# EAGLE design HackRPI-Badge (EAGLE 7.6.0)
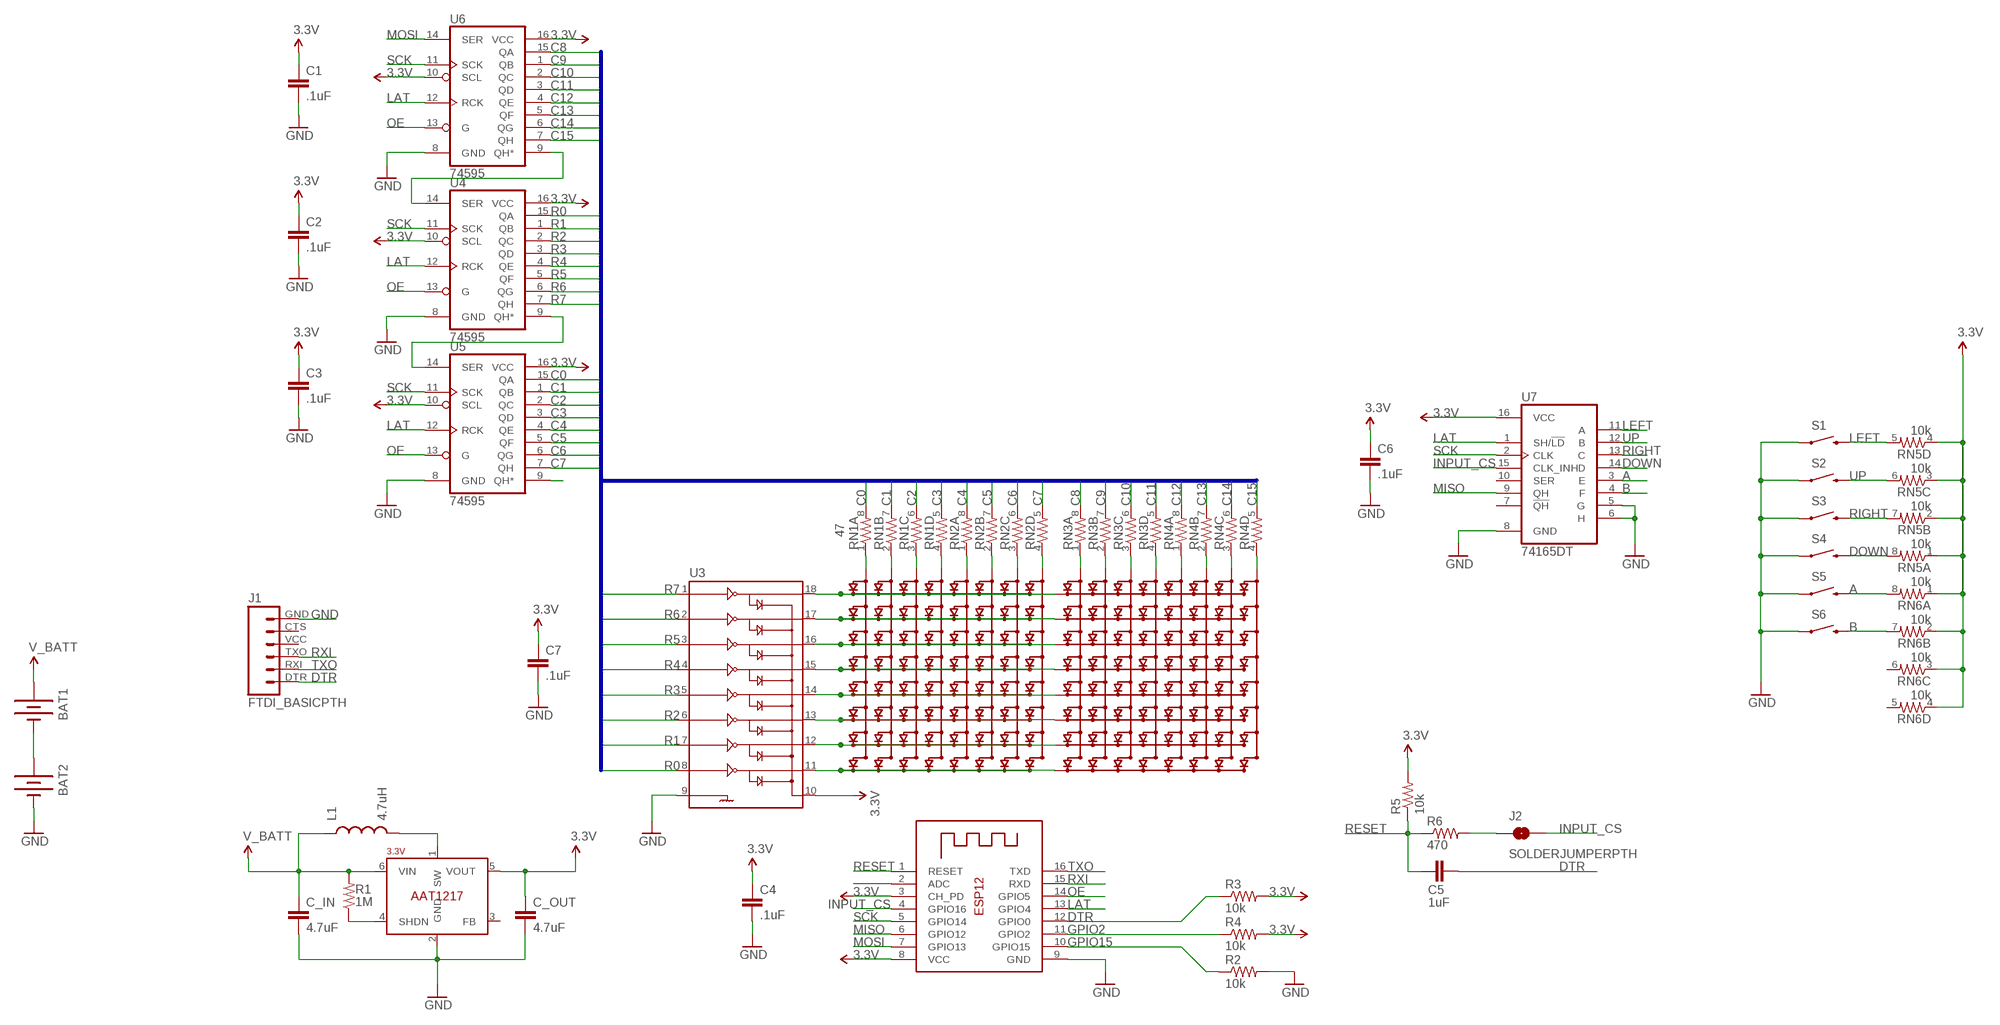
[diagram p0: schematic, sheet 1]

## Parts
BAT1  BATTERYAAA  [BATTERY-AAA]
BAT2  BATTERYAAA  [BATTERY-AAA]
C1  .1uF  CAP0603-CAP  [0603-CAP]
C2  .1uF  CAP0603-CAP  [0603-CAP]
C3  .1uF  CAP0603-CAP  [0603-CAP]
C4  .1uF  CAP0603-CAP  [0603-CAP]
C5  1uF  CAP0603-CAP  [0603-CAP]
C6  .1uF  CAP0603-CAP  [0603-CAP]
C7  .1uF  CAP0603-CAP  [0603-CAP]
C_IN  4.7uF  CAP0805  [0805]
C_OUT  4.7uF  CAP0805  [0805]
J1  FTDI_BASICPTH  [FTDI_BASIC]
J2  SOLDERJUMPERPTH  [SJ_2S-PTH]
L1  4.7uH  INDUCTOR1007  [1007]
LED_LEFT  8X8LEDMATRIX_COLUMN_CATHODELDM-13488MI  [32MM_LEDMATRIX]
LED_RIGHT  8X8LEDMATRIX_COLUMN_CATHODELDM-13488MI  [32MM_LEDMATRIX]
R1  1M  RESISTOR0603  [0603-RES]
R2  10k  RESISTOR0603  [0603-RES]
R3  10k  RESISTOR0603  [0603-RES]
R4  10k  RESISTOR0603  [0603-RES]
R5  10k  RESISTOR0603  [0603-RES]
R6  470  RESISTOR0603  [0603-RES]
RN1  47  RESISTOR-ARRAY0603-ARV  [0603-ARV]
RN2  47  RESISTOR-ARRAY0603-ARV  [0603-ARV]
RN3  47  RESISTOR-ARRAY0603-ARV  [0603-ARV]
RN4  47  RESISTOR-ARRAY0603-ARV  [0603-ARV]
RN5  10k  RESISTOR-ARRAY0603-ARV  [0603-ARV]
RN6  10k  RESISTOR-ARRAY0603-ARV  [0603-ARV]
S1  SWITCH-MOMENTARY-2PTH  [TACTILE-PTH]
S2  SWITCH-MOMENTARY-2PTH  [TACTILE-PTH]
S3  SWITCH-MOMENTARY-2PTH  [TACTILE-PTH]
S4  SWITCH-MOMENTARY-2PTH  [TACTILE-PTH]
S5  SWITCH-MOMENTARY-2PTH  [TACTILE-PTH]
S6  SWITCH-MOMENTARY-2PTH  [TACTILE-PTH]
U1  ESP-12  [ESP-12]
U2  3.3V  AAT1217  [SOT23-6]
U3  ULN2803SOICW  [SO18L]
U4  74595  [TSSOP16]
U5  74595  [TSSOP16]
U6  74595  [TSSOP16]
U7  74165DT  [TSSOP16]

## Nets
3.3V [power]: C1.1 C2.1 C3.1 C4.1 C6.1 C7.1 C_OUT.1 R3.2 R4.2 R5.2 RN5.1 RN5.2 RN5.3 RN5.4 RN6.1 RN6.2 RN6.3 RN6.4 U1.3(CH_PD) U1.8(VCC) U2.5(VOUT) U3.10 U4.10(SCL) U4.16(VCC) U5.10(SCL) U5.16(VCC) U6.10(SCL) U6.16(VCC) U7.16(VCC)
A: RN6.8 S5.3 U7.3(E)
B: RN6.7 S6.3 U7.4(F)
C0: RN1.8 U5.15(QA)
C1: RN1.7 U5.1(QB)
C2: RN1.6 U5.2(QC)
C3: RN1.5 U5.3(QD)
C4: RN2.8 U5.4(QE)
C5: RN2.7 U5.5(QF)
C6: RN2.6 U5.6(QG)
C7: RN2.5 U5.7(QH)
C8: RN3.8 U6.15(QA)
C9: RN3.7 U6.1(QB)
C10: RN3.6 U6.2(QC)
C11: RN3.5 U6.3(QD)
C12: RN4.8 U6.4(QE)
C13: RN4.7 U6.5(QF)
C14: RN4.6 U6.6(QG)
C15: RN4.5 U6.7(QH)
DOWN: RN5.8 S4.3 U7.14(D)
DTR: C5.2 J1.DTR R3.1 U1.12(GPIO0)
GND [power]: BAT2.GND@1(-) C1.2 C2.2 C3.2 C4.2 C6.2 C7.2 C_IN.2 C_OUT.2 J1.GND R2.2 S1.1 S2.1 S3.1 S4.1 S5.1 S6.1 U1.9(GND) U2.2(GND) U3.9 U4.8(GND) U5.8(GND) U6.8(GND) U7.5(G) U7.6(H) U7.8(GND)
GPIO2: R4.1 U1.11(GPIO2)
GPIO15: R2.1 U1.10(GPIO15)
INPUT_CS: J2.2 U1.4(GPIO16) U7.15(CLK_INH)
LAT: U1.13(GPIO4) U4.12(RCK) U5.12(RCK) U6.12(RCK) U7.1(SH/!LD)
LEFT: RN5.5 S1.3 U7.11(A)
MISO: U1.6(GPIO12) U7.9(QH)
MOSI: U1.7(GPIO13) U6.14(SER)
N$1: J2.1 R6.2
N$2: U1.2(ADC)
N$3: LED_LEFT.13(C1) RN1.1
N$4: LED_LEFT.3(C2) RN1.2
N$5 [power]: L1.2 U2.1(SW)
N$6: R1.1 U2.4(SHDN)
N$7: LED_LEFT.9(R1) LED_RIGHT.9(R1) U3.18
N$8: LED_LEFT.4(C3) RN1.3
N$9: LED_LEFT.10(C4) RN1.4
N$10: LED_LEFT.6(C5) RN2.1
N$11: LED_LEFT.11(C6) RN2.2
N$12: LED_LEFT.15(C7) RN2.3
N$13: LED_LEFT.16(C8) RN2.4
N$14: LED_LEFT.14(R2) LED_RIGHT.14(R2) U3.17
N$15: LED_LEFT.8(R3) LED_RIGHT.8(R3) U3.16
N$16: LED_LEFT.12(R4) LED_RIGHT.12(R4) U3.15
N$17: LED_LEFT.1(R5) LED_RIGHT.1(R5) U3.14
N$18: LED_LEFT.7(R6) LED_RIGHT.7(R6) U3.13
N$19: LED_LEFT.2(R7) LED_RIGHT.2(R7) U3.12
N$20: LED_LEFT.5(R8) LED_RIGHT.5(R8) U3.11
N$21: U4.9(QH*) U5.14(SER)
N$22: U4.14(SER) U6.9(QH*)
N$23: LED_RIGHT.13(C1) RN3.1
N$24: LED_RIGHT.3(C2) RN3.2
N$25: LED_RIGHT.4(C3) RN3.3
N$26: LED_RIGHT.10(C4) RN3.4
N$27: LED_RIGHT.6(C5) RN4.1
N$28: LED_RIGHT.11(C6) RN4.2
N$29: LED_RIGHT.15(C7) RN4.3
N$30: LED_RIGHT.16(C8) RN4.4
N$31 [power]: BAT1.GND@1(-) BAT2.PWR@1(+)
N$33: U5.9(QH*)
OE: U1.14(GPIO5) U4.13(G) U5.13(G) U6.13(G)
R0: U3.8 U4.15(QA)
R1: U3.7 U4.1(QB)
R2: U3.6 U4.2(QC)
R3: U3.5 U4.3(QD)
R4: U3.4 U4.4(QE)
R5: U3.3 U4.5(QF)
R6: U3.2 U4.6(QG)
R7: U3.1 U4.7(QH)
RESET: C5.1 R5.1 R6.1 U1.1(RESET)
RIGHT: RN5.7 S3.3 U7.13(C)
RXI: J1.TXO U1.15(RXD)
SCK: U1.5(GPIO14) U4.11(SCK) U5.11(SCK) U6.11(SCK) U7.2(CLK)
TXO: J1.RXI U1.16(TXD)
UP: RN5.6 S2.3 U7.12(B)
V_BATT [power]: BAT1.PWR@1(+) C_IN.1 L1.1 R1.2 U2.6(VIN)
Unconnected: J1.CTS J1.VCC RN6.5 RN6.6 U2.3(FB) U7.7(!QH) U7.10(SER)

## Buses
R[0..7],C[0..15]

## Library data of the parts
BAT1 BAT2 = SparkFun-Electromechanical:BATTERY: Battery Holders Various common sizes : AA, AAA, 18650 (PRT-12895), 20mm coin cell and 12mm coin cell. 20MM_4LEGS, BATT-10373; PARTNO: BK-82; PROD_ID: BATT-08571
C1-C4 C6 C7 = SparkFun-Capacitors:CAP: Capacitor Standard 0603 ceramic capacitor, and 0.1" leaded capacitor.; PARTNO: CC0603ZRY5V9BB104
C5 = SparkFun-Capacitors:CAP: Capacitor Standard 0603 ceramic capacitor, and 0.1" leaded capacitor.
C_IN C_OUT = SparkFun-Capacitors:CAP: Capacitor Standard 0603 ceramic capacitor, and 0.1" leaded capacitor.; PARTNO: CL21A475KQFNNNG
J1 = SparkFun-Connectors:FTDI_BASIC: FTDI Basic header with labels
J2 = SparkFun-Retired:SOLDERJUMPER: Solder Jumper Standard SMD solder jumper. Used to automate production. Two varients : Normally Open and Normally Closed are the same, but have different paste layers. NC will have a large amount of paste and should jumper during reflow.
L1 = SparkFun-Passives:INDUCTOR: Inductors Basic Inductor/Choke - 0603 and 1206. Footprints are not proven and vary greatly between part numbers. INDUCTOR POWER 3.3UH 4.0A SMD 0.197" L x 0.197" W x 0.177" H (5.00mm x 5.00mm x 4.50mm); PARTNO: CIG22L4R7MNE
LED_LEFT LED_RIGHT = mylib:8X8LEDMATRIX_COLUMN_CATHODE; PARTNO: LDM-13488MI
R1 = SparkFun-Resistors:RESISTOR: Resistor Basic schematic elements and footprints for 0603, 1206, and PTH resistors.; PARTNO: RC0603JR-071ML
R2-R5 = SparkFun-Resistors:RESISTOR: Resistor Basic schematic elements and footprints for 0603, 1206, and PTH resistors.; PARTNO: RC0603JR-0710KL
R6 = SparkFun-Resistors:RESISTOR: Resistor Basic schematic elements and footprints for 0603, 1206, and PTH resistors.; PARTNO: RC0603JR-07470RL
RN1-RN4 = SparkFun-Passives:RESISTOR-ARRAY: Array Chip Resistor Source: RS Component / Phycomp; PARTNO: YC164-JR-0747RL
RN5 RN6 = SparkFun-Passives:RESISTOR-ARRAY: Array Chip Resistor Source: RS Component / Phycomp; PARTNO: 742C083103JP
S1-S6 = SparkFun-Electromechanical:SWITCH-MOMENTARY-2: Various NO switches- pushbuttons, reed, etc; PARTNO: 1825910-6; PROD_ID: SWCH-08441
U1 = adafruit:ESP-12; PARTNO: 2491
U2 = mylib:AAT1217; PARTNO: AAT1217ICA-3.3-T1
U3 = SparkFun-PowerIC:ULN2803: Darlington Driver ULN2803 Darlington array. 500mA max per channel, 8-channel package. Spark Fun Electronics SKU : COM-00312; PARTNO: ULN2803AFWG,C,EL
U4-U6 = SparkFun-DigitalIC:74*595: 8-bit SHIFT REGISTER, output latch; PARTNO: 74HC595PW,118
U7 = mylib:74*165; PARTNO: MC74HC165ADTR2G

## Net classes
0 default: width 0.406 mm
1 power: width 0.508 mm

## Board
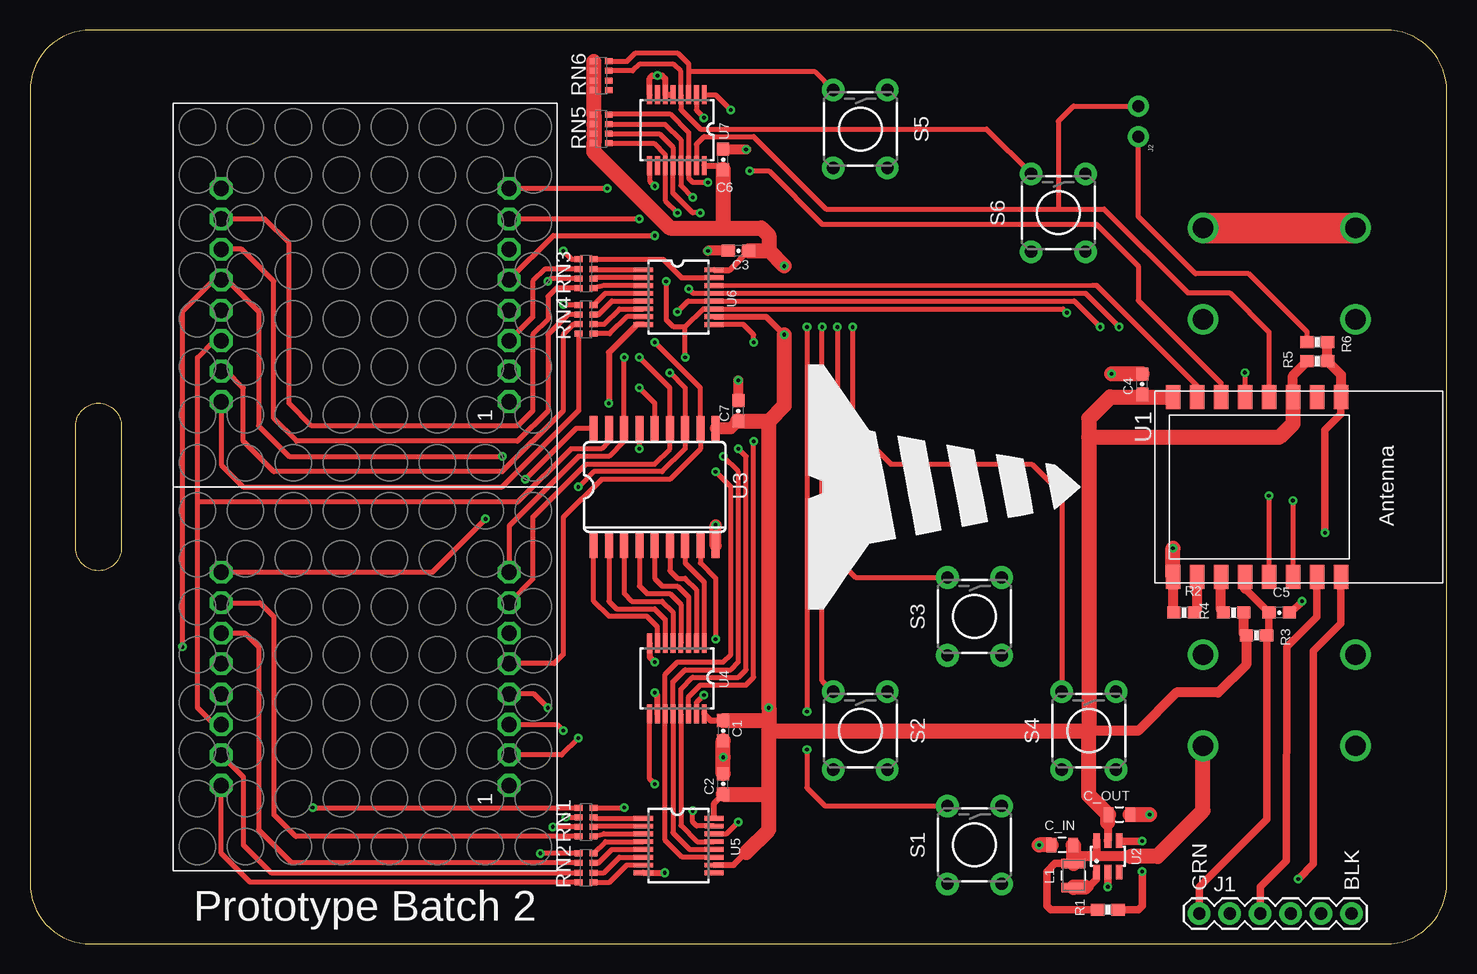
[diagram p1: board, top side]
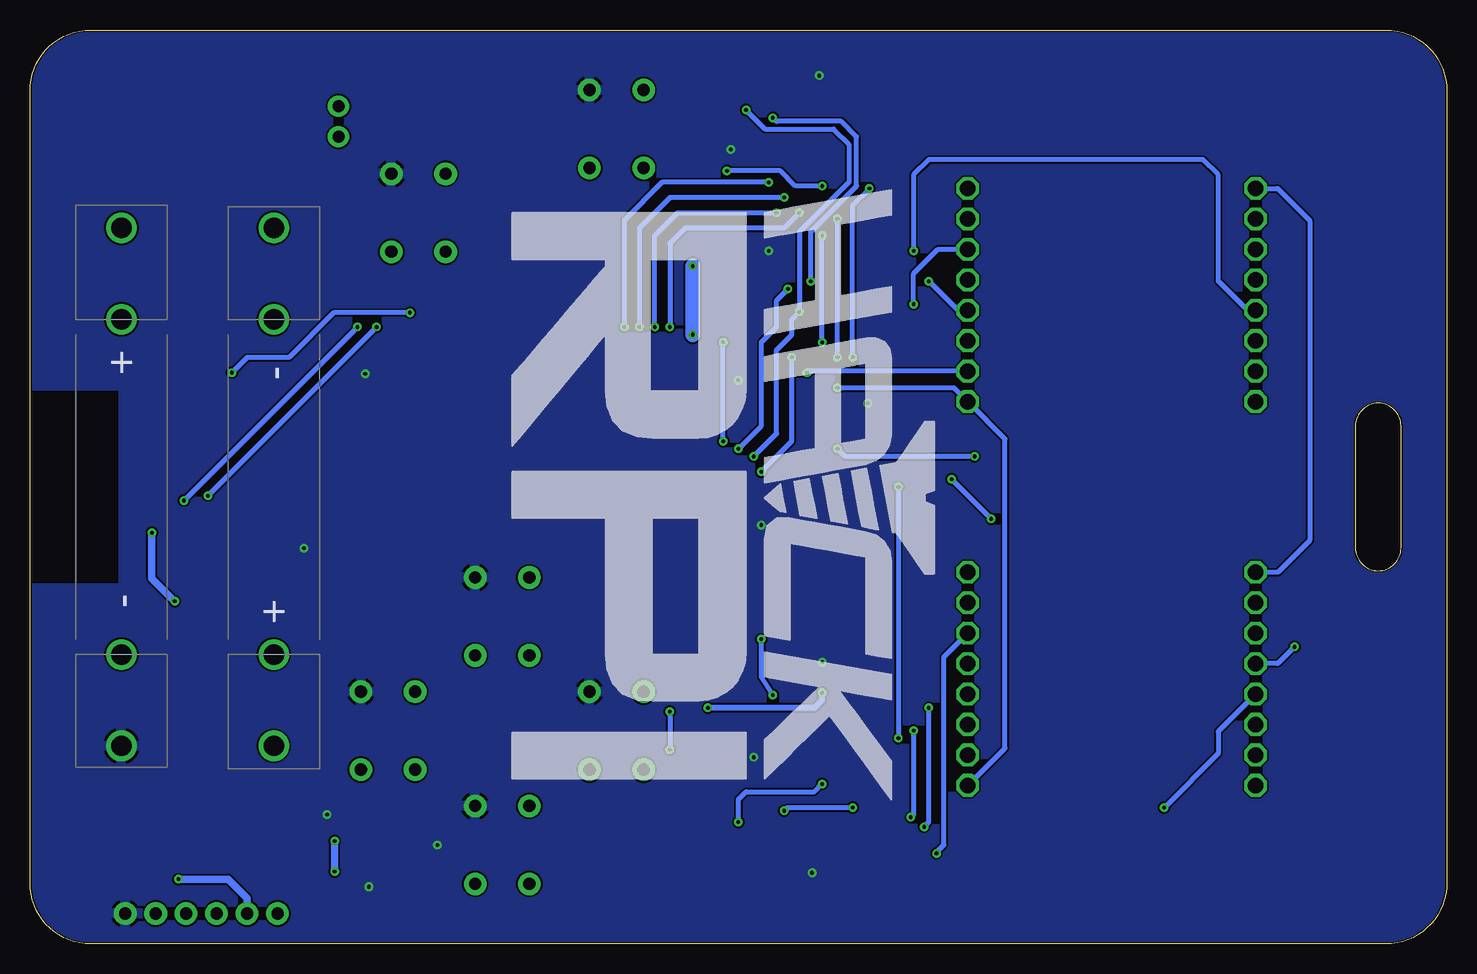
[diagram p2: board, bottom side, seen from below]

Size 118.11 x 76.2 mm. Coordinates in mm from the lower left corner, seen from the top.
Outline: 0,5.08 arc90 5.08,0 113.03,0 arc90 118.11,5.08 118.11,71.12 arc90 113.03,76.2 5.08,76.2 arc90 0,71.12 0,5.08
Outline: 7.62,43.18 7.62,33.02 arc-180 3.81,33.02 3.81,43.18 arc-180 7.62,43.18
Copper layers (1*16): Top 0.035mm / dielectric 1.5mm / Bottom 0.035mm
Design rules "pcbway *": minimum track width 6mil, minimum drill 12mil, track to track 6mil, track to pad 6mil, pad to pad 6mil, via to via 6mil, smd to smd 6mil, copper to edge 6mil, drill to drill 6mil, minimum pad ring 10mil, minimum via ring 8mil, stop-mask expansion 4mil, vias tented up to drill 15mil, thermal gap 10mil

### Footprints (pad centres in the part's own frame; a part is rotated, then mirrored left to right if it is on the bottom)
BATTERY-AAA = drill 1.702: GND@1 21.59,0; GND@2 13.97,0; PWR@1 -21.59,0; PWR@2 -13.97,0
0603-CAP = smd 1.1 x 1: 1 -0.85,0; 2 0.85,0
0805 = smd 0.8 x 1.2: 1 -0.9,0; 2 0.9,0
FTDI_BASIC = drill 1.016 pad 1.88: CTS 10.16,0; DTR 0,0; GND 12.7,0; RXI 2.54,0; TXO 5.08,0; VCC 7.62,0
SJ_2S-PTH = drill 1.016 pad 1.778: 1 -1.27,0; 2 1.27,0
1007 = smd 2 x 0.8: 1 0,1; 2 0,-1
32MM_LEDMATRIX = drill 1.27 octagon: 1 -8.89,-12; 2 -6.35,-12; 3 -3.81,-12; 4 -1.27,-12; 5 1.27,-12; 6 3.81,-12; 7 6.35,-12; 8 8.89,-12; 9 8.89,12; 10 6.35,12; 11 3.81,12; 12 1.27,12; 13 -1.27,12; 14 -3.81,12; 15 -6.35,12; 16 -8.89,12
0603-RES = smd 1.1 x 1: 1 -0.85,0; 2 0.85,0
0603-ARV = smd 0.5 x 0.65: 1 -1.2,-0.625; 2 -0.4,-0.625; 3 0.4,-0.625; 4 1.2,-0.625; 5 1.2,0.625; 6 0.4,0.625; 7 -0.4,0.625; 8 -1.2,0.625
TACTILE-PTH = drill 1.016 pad 1.88: 1 -3.251,2.261; 2 3.251,2.261; 3 -3.251,-2.261; 4 3.251,-2.261
ESP-12 = smd 2 x 1.2: 1 -7.5,4.5; 2 -7.5,2.5; 3 -7.5,0.5; 4 -7.5,-1.5; 5 -7.5,-3.5; 6 -7.5,-5.5; 7 -7.5,-7.5; 8 -7.5,-9.5; 9 7.5,-9.5; 10 7.5,-7.5; 11 7.5,-5.5; 12 7.5,-3.5; 13 7.5,-1.5; 14 7.5,0.5; 15 7.5,2.5; 16 7.5,4.5
SOT23-6 = smd 0.55 x 1.2: 1 0.95,1.3; 2 0,1.3; 3 -0.95,1.3; 4 -0.95,-1.3; 5 0,-1.3; 6 0.95,-1.3
SO18L = smd 0.66 x 2.032: 1 -0.635,-4.902; 2 0.635,-4.902; 3 1.905,-4.902; 4 3.175,-4.902; 5 4.445,-4.902; 6 5.715,-4.902; 7 6.985,-4.902; 8 8.255,-4.902; 9 9.525,-4.902; 10 9.525,4.902; 11 8.255,4.902; 12 6.985,4.902; 13 5.715,4.902; 14 4.445,4.902; 15 3.175,4.902; 16 1.905,4.902; 17 0.635,4.902; 18 -0.635,4.902
TSSOP16 = smd 0.4 x 1.6: 1 -2.225,-2.85; 2 -1.575,-2.85; 3 -0.925,-2.85; 4 -0.275,-2.85; 5 0.375,-2.85; 6 1.025,-2.85; 7 1.675,-2.85; 8 2.325,-2.85; 9 2.325,3.05; 10 1.675,3.05; 11 1.025,3.05; 12 0.375,3.05; 13 -0.275,3.05; 14 -0.925,3.05; 15 -1.575,3.05; 16 -2.225,3.05

### Placement (x,y rotation side)
BAT1  97.79,38.1 90 bottom
BAT2  110.49,38.1 270 bottom
C1  57.78,17.78 270 top
C2  57.78,13.34 90 top
C3  59.05,57.78 180 top
C4  92.71,46.67 90 top
C5  104.14,27.62 180 top
C6  57.78,65.41 90 top
C7  59.05,44.45 90 top
C_IN  86.04,8.26 180 top
C_OUT  90.81,10.79 0 top
J1  97.47,2.54 0 top
J2  92.39,68.58 90 top
L1  87,5.71 0 top
LED_LEFT  27.94,22.1 90 top
LED_RIGHT  27.94,54.1 90 top
R1  89.85,2.86 180 top
R2  96.2,27.62 180 top
R3  102.23,25.72 180 top
R4  100.33,27.62 0 top
R5  107.31,48.58 180 top
R6  107.31,50.16 180 top
RN1  46.35,10.16 270 top
RN2  46.35,6.35 270 top
RN3  46.35,55.88 270 top
RN4  46.35,52.07 270 top
RN5  47.62,67.94 270 top
RN6  47.62,72.39 270 top
S1  78.74,8.26 270 top
S2  69.22,17.78 270 top
S3  78.74,27.3 270 top
S4  88.27,17.78 270 top
S5  69.22,67.94 270 top
S6  85.72,60.96 270 top
U1  104.78,38.1 270 top
U2  89.85,7.3 180 top
U3  47.62,38.1 0 top
U4  53.98,22.23 180 top
U5  53.98,8.26 270 top
U6  53.98,53.98 270 top
U7  53.98,67.94 180 top
U$1  [HACKRPI-LOGO]  60.33,37.47 270 bottom
U$2  [HACKRPI-SCREW]  76.2,38.1 90 top

### Tracks (layer width: path | path; a pad name or v marks a point on that pad's centre or on a via)
3.3V  (via drill 0.3)
  Top 0.508: U6.16 58.32,56.2 C3.1 | U5.10 58.65,6.58 59.69,7.62 | RN5.1 46.99,69.16 | RN5.4 | U7.16 57.45,64.89 C6.1 | C1.1 56.74,18.63 U4.16 56.2,19.37 | U5.16 57.02,11.72 C2.1 | U4.10 52.3,20.73 v52.07,20.95 | U6.10 61.37,52.3 v62.87,50.8
  Top 0.66: 89.85,10.11 U2.5
  Top 0.813: U1.3 105.28,47.39 R5.2 | R4.2 101.18,25.92 R3.2 101.39,23.28 99.06,20.95 95.57,20.95 92.39,17.78 88.27,17.78
  Top 1.016: U3.10 58.42,43 59.02,43.6
  Top 1.27: RN5.4 RN5.3 RN5.2 RN5.1 RN6.4 RN6.3 RN6.2 RN6.1 | RN5.4 46.99,66.04 53.34,59.69 57.78,59.69 | C6.1 57.78,59.69 | 57.78,59.69 60.96,59.69 61.59,59.05 61.59,57.78 | 61.59,57.78 v62.87,56.52 | v62.87,50.8 62.87,44.87 61.59,43.6 | 59.02,43.6 C7.1 61.59,43.6 | C1.1 61.38,18.63 61.59,18.41 | 61.59,43.6 v61.59,19.68 61.59,18.41 | 59.69,7.62 61.59,9.53 61.59,12.48 | 61.59,12.48 61.59,17.78 | C2.1 61.59,12.48 | C3.1 61.59,57.78 | 61.59,17.78 88.27,17.78 | 61.59,18.41 61.59,17.78 | 92.71,45.6 90.05,45.6 88.27,43.81 88.27,42.23 | 92.71,45.6 U1.8 | U1.3 105.28,43.36 104.14,42.23 88.27,42.23 | C4.1 92.71,45.6 | 89.85,10.11 89.85,10.79 | 89.85,10.79 88.27,12.38 88.27,17.78 | C_OUT.1 89.85,10.79 | 88.27,42.23 88.27,17.78
  Bottom 0.508: v52.07,20.95 52.07,20.32 52.7,19.68 v61.59,19.68
  Bottom 1.27: v62.87,56.52 v62.87,50.8
A
  Top 0.406: 54.9,70.19 U7.3 54.9,72.71 | S5.3 65.44,72.71 54.9,72.71 | RN6.8 49.78,73.59 50.48,74.3 53.98,74.3 54.9,73.37 54.9,72.71
B
  Top 0.406: RN6.7 50.25,72.79 50.8,73.34 53.66,73.34 54.25,72.75 U7.4 54.25,69.58 55.88,67.94 79.73,67.94 S6.3
C0  (via drill 0.3)
  Top 0.406: RN1.8 v49.53,11.36 | U5.15 55.58,9.83 55.24,10.16 v55.24,11.1
  Bottom 0.406: v49.53,11.36 54.98,11.36 v55.24,11.1
C1
  Top 0.406: RN1.7 47.06,10.48 U5.1
C2
  Top 0.406: RN1.6 47.05,9.83 U5.2
C3
  Top 0.406: U5.3 47.84,9.18 RN1.5
C4
  Top 0.406: U5.4 47.96,8.53 RN2.8
C5
  Top 0.406: U5.5 48.52,7.88 47.39,6.75 RN2.7
C6
  Top 0.406: RN2.6 47.86,5.95 49.14,7.23 U5.6
C7
  Top 0.406: RN2.5 48.33,5.15 49.76,6.58 U5.7
C8
  Top 0.406: RN3.8 52.77,57.08 54.3,55.55 U6.15
C9
  Top 0.406: U6.1 47.06,56.2 RN3.7
C10
  Top 0.406: U6.2 47.05,55.55 RN3.6
C11
  Top 0.406: U6.3 47.84,54.9 RN3.5
C12
  Top 0.406: RN4.8 47.96,54.25 U6.4
C13
  Top 0.406: U6.5 48.52,53.6 47.39,52.47 RN4.7
C14
  Top 0.406: RN4.6 47.86,51.67 49.14,52.95 U6.6
C15
  Top 0.406: U6.7 49.76,52.3 48.33,50.87 RN4.5
DOWN  (via drill 0.3)
  Top 0.406: RN5.8 48.32,69.22 53.34,69.22 54.9,67.66 U7.14 54.9,63.84 55.24,63.5 v56.52,63.5 | v68.58,51.44 68.58,43.18 71.75,40.01 83.5,40.01 86,37.5 S4.3
  Bottom 0.406: v56.52,63.5 65.41,63.5 68.58,60.33 v68.58,51.44
DTR
  Top 0.61: 101.28,29.64 C5.2 103.29,25.92 R3.1 103.08,10.38 97.47,4.76 J1.DTR
  Top 0.813: 101.28,29.64 U1.12
GND  (via drill 0.3)
  Top 0.508: U5.8 v52.92,5.93 | U4.8 51.65,23.91 v52.07,23.5 | U6.8 50.59,51.65 48.26,49.33 v48.26,45.09 | U7.5 U7.6 52.95,72.14 52.7,72.39 v52.31,72.39 51.87,72.39 51.65,72.17 U7.8
  Top 0.61: U2.2 v89.85,4.76
  Top 0.813: C7.2 v59.05,46.99 | C3.2 v56.52,57.78 | C6.2 v59.69,66.25 | U1.9 95.28,28.02 R2.2
  Top 1.016: U3.9 v57.15,34.92
  Top 1.27: C1.2 v57.78,15.56 C2.2 | C_OUT.2 v93.34,10.79 | C_IN.2 v84.14,8.26 | U1.9 v95.28,32.99 | C4.2 v90.17,47.52
  pour Bottom: 0,76.2 118.11,76.2 118.11,0 0,0
GPIO2
  Top 0.813: R4.1 99.28,27.83 U1.11
GPIO15
  Top 0.813: U1.10 97.28,27.84 R2.1
INPUT_CS
  Top 0.406: 85.72,61.28 66.36,61.28 60.33,67.31 56.2,67.31 55.55,66.66 U7.15 | 85.72,61.28 89.53,61.28 96.52,54.29 100.01,54.29 103.28,51.03 U1.4 | J2.2 87,69.85 85.72,68.58 85.72,61.28
LAT  (via drill 0.3)
  Top 0.406: U5.12 54.98,7.88 53.6,9.27 U4.12 53.6,21.85 54.61,22.86 58.42,22.86 59.05,23.5 59.05,39.37 v57.78,40.64 | v53.98,52.7 54.87,53.6 U6.12 87.05,53.6 v89.22,51.44 | U7.1 57.16,70.8 v58.42,69.53 | v103.28,37.38 U1.13
  Bottom 0.406: v57.78,40.64 55.88,42.55 55.88,49.53 54.61,50.8 54.61,52.07 v53.98,52.7 53.98,59.37 49.85,63.5 49.85,66.67 51.12,67.94 56.83,67.94 v58.42,69.53 | v89.22,51.44 v103.28,37.38
LEFT  (via drill 0.3)
  Top 0.406: RN5.5 52,66.75 52.95,65.8 U7.11 52.95,61.98 v53.98,60.96 | v64.77,51.44 v64.77,19.37 | v64.77,16.19 64.77,13.02 66.28,11.51 S1.3
  Bottom 0.406: v53.98,60.96 55.24,59.69 63.5,59.69 64.77,58.42 v64.77,51.44 | v64.77,19.37 v64.77,16.19
MISO  (via drill 0.3)
  Top 0.406: U7.9 51.65,63.6 v52.07,63.18 | v60.01,64.45 61.59,64.45 66.04,60.01 88.9,60.01 92.39,56.52 92.39,53.66 99.28,46.77 U1.6
  Bottom 0.406: v52.07,63.18 54.29,63.18 55.56,64.45 v60.01,64.45
MOSI
  Top 0.406: U6.14 88.58,54.93 88.9,54.93 97.28,46.55 U1.7
N$1
  Top 0.406: R6.2 106.47,51.02 101.6,55.88 97.16,55.88 92.39,60.64 J2.1
N$3  (via drill 0.3)
  Top 0.406: v23.57,11.36 RN1.1
  Bottom 0.406: LED_LEFT.13 19.05,17.72 19.05,15.88 v23.57,11.36
N$4  (via drill 0.3)
  Top 0.406: LED_LEFT.3 43.94,18.29 v44.45,17.78 | v44.69,10.56 RN1.2
  Bottom 0.406: v44.45,17.78 44.45,10.79 v44.69,10.56
N$5
  Top 0.61: 88.27,4.76 88.9,5.4 U2.1
  Top 0.813: 87.95,4.76 88.27,4.76
  Top 1.27: L1.2 87,4.76 87.95,4.76
N$6  (via drill 0.3)
  Top 0.61: R1.1 92.39,2.86 92.71,3.17 v92.71,6.03 | v92.71,8.57 90.83,8.57 U2.4
  Bottom 0.61: v92.71,6.03 v92.71,8.57
N$7  (via drill 0.3)
  Top 0.406: v37.98,35.44 33.53,30.99 LED_LEFT.9 | v41.27,38.73 45.54,43 U3.18
  Bottom 0.406: v37.98,35.44 v41.27,38.73 | LED_LEFT.9 14.1,30.99 11.43,33.66 11.43,60.33 14.1,62.99 LED_RIGHT.9
N$8  (via drill 0.3)
  Top 0.406: RN1.3 v43.58,9.76 | v43.18,19.68 42.03,20.83 LED_LEFT.4
  Bottom 0.406: v43.58,9.76 43.18,10.16 v43.18,19.68
N$9
  Top 0.406: RN1.4 22.16,8.96 20.32,10.79 20.32,27.3 19.18,28.45 LED_LEFT.10
N$10  (via drill 0.3)
  Top 0.406: RN2.1 v42.55,7.55
  Bottom 0.406: v42.55,7.55 42.55,7.62 41.91,8.26 41.91,23.94 LED_LEFT.6
N$11
  Top 0.406: RN2.2 21.82,6.75 19.05,9.53 19.05,24.77 17.91,25.91 LED_LEFT.11
N$12
  Top 0.406: LED_LEFT.15 17.78,13.91 17.78,8.26 20.09,5.95 RN2.3
N$13
  Top 0.406: RN2.4 18.34,5.15 15.94,7.55 LED_LEFT.16
N$14
  Top 0.406: LED_LEFT.14 15.37,18.29 13.97,19.68 13.97,36.83 | 13.97,36.83 13.97,48.9 15.37,50.29 LED_RIGHT.14 | U3.17 48.26,41.91 47.62,41.27 45.09,41.27 40.64,36.83 13.97,36.83
N$15  (via drill 0.3)
  Top 0.406: v49.53,48.9 U3.16 49.53,41.91 48.26,40.64 45.72,40.64 39.94,34.86 LED_LEFT.8 | v48.13,62.99 LED_RIGHT.8
  Bottom 0.406: v49.53,48.9 49.53,61.59 v48.13,62.99
N$16  (via drill 0.3)
  Top 0.406: v12.7,24.77 12.7,52.7 15.37,55.37 LED_RIGHT.12 16.39,55.37 19.05,52.7 19.05,43.18 21.59,40.64 v39.37,40.64 | v50.8,41.27 U3.15
  Bottom 0.406: v12.7,24.77 14.1,23.37 LED_LEFT.12 | v39.37,40.64 50.16,40.64 v50.8,41.27
N$17  (via drill 0.3)
  Top 0.406: v50.8,46.35 52.07,45.09 U3.14
  Bottom 0.406: LED_LEFT.1 36.83,16.32 36.83,42.1 LED_RIGHT.1 41.09,46.35 v50.8,46.35
N$18  (via drill 0.3)
  Top 0.406: v50.8,48.9 53.34,46.35 U3.13 53.34,41.27 52.07,40.01 46.35,40.01 41.91,35.56 41.91,30.42 LED_LEFT.7 | v50.8,60.45 LED_RIGHT.7
  Bottom 0.406: v50.8,48.9 v50.8,60.45
N$19  (via drill 0.3)
  Top 0.406: v53.34,47.62 54.61,46.35 U3.12 54.61,41.27 52.7,39.37 46.99,39.37 v45.72,38.1 | v45.72,17.14 44.33,15.75 LED_LEFT.2
  Bottom 0.406: LED_RIGHT.2 53.22,47.75 v53.34,47.62 | v45.72,38.1 v45.72,17.14
N$20  (via drill 0.3)
  Top 0.406: v52.07,50.16 55.88,46.35 U3.11 55.88,41.27 53.34,38.73 47.62,38.73 44.45,35.56 44.45,24.13 43.69,23.37 LED_LEFT.5 | LED_RIGHT.5 43.62,59.05 v52.07,59.05
  Bottom 0.406: v52.07,50.16 v52.07,59.05
N$21  (via drill 0.3)
  Top 0.406: v59.05,10.16 58.08,9.18 U5.14 | v52.07,13.34 51.65,13.76 U4.9
  Bottom 0.406: v59.05,10.16 59.05,12.06 58.42,12.7 52.7,12.7 v52.07,13.34
N$22  (via drill 0.3)
  Top 0.406: U4.14 54.9,20.61 55.88,21.59 59.69,21.59 60.33,22.23 v60.33,41.91 | v60.33,50.16 60.33,50.8 59.48,51.65 U6.9
  Bottom 0.406: v60.33,41.91 v60.33,50.16
N$23  (via drill 0.3)
  Top 0.406: v44.45,57.78 45.16,57.08 RN3.1
  Bottom 0.406: LED_RIGHT.13 16.64,52.83 19.05,55.24 19.05,64.14 20.32,65.41 43.18,65.41 44.45,64.14 v44.45,57.78
N$24
  Top 0.406: RN3.2 42.95,56.28 41.91,55.24 41.91,52.26 LED_RIGHT.3
N$25  (via drill 0.3)
  Top 0.406: RN3.3 43.41,55.48 v43.18,55.24
  Bottom 0.406: v43.18,55.24 40.77,52.83 LED_RIGHT.4
N$26
  Top 0.406: RN3.4 43.88,54.68 43.18,53.98 43.18,52.07 41.91,50.8 41.91,44.45 40.64,43.18 23.5,43.18 21.59,45.09 21.59,58.42 19.56,60.45 LED_RIGHT.10
N$27  (via drill 0.3)
  Top 0.406: RN4.1 44.52,53.27 v44.45,53.34
  Bottom 0.406: v44.45,53.34 44.45,55.88 42.42,57.91 LED_RIGHT.6
N$28
  Top 0.406: RN4.2 44.85,52.47 43.18,50.8 43.18,44.45 40.64,41.91 22.23,41.91 20.32,43.81 20.32,55.24 17.66,57.91 LED_RIGHT.11
N$29
  Top 0.406: RN4.3 45.32,51.67 44.45,50.8 44.45,44.45 39.37,39.37 20.32,39.37 17.78,41.91 17.78,46.35 16.39,47.75 LED_RIGHT.15
N$30
  Top 0.406: LED_RIGHT.16 15.94,39.94 17.78,38.1 39.37,38.1 45.73,44.46 RN4.4
N$31
  Top 2.54: BAT1.GND@1 BAT2.PWR@1
OE  (via drill 0.3)
  Top 0.406: U5.13 55.6,8.53 54.25,9.88 U4.13 54.25,21.23 55.24,22.23 59.05,22.23 59.69,22.86 59.69,40.64 v59.05,41.27 | v54.93,54.61 55.29,54.25 U6.13 87.99,54.25 v90.81,51.44 | v105.28,36.97 U1.14
  Bottom 0.406: v59.05,41.27 57.15,43.18 57.15,50.16 55.88,51.44 55.88,53.66 v54.93,54.61 | v90.81,51.44 v105.28,36.97
R0  (via drill 0.3)
  Top 0.406: U3.8 55.88,31.75 57.15,30.48 v57.15,25.4 | v56.19,20.75 55.55,20.12 U4.15
  Bottom 0.406: v56.19,20.75 57.15,22.23 v57.15,25.4
R1
  Top 0.406: U3.7 54.61,31.75 56.2,30.16 U4.1
R2
  Top 0.406: U3.6 53.34,31.11 53.98,30.48 54.61,30.48 55.55,29.54 U4.2
R3
  Top 0.406: U3.5 52.07,30.48 52.7,29.84 53.98,29.84 54.9,28.92 U4.3
R4
  Top 0.406: U3.4 50.8,29.84 51.44,29.21 53.34,29.21 54.25,28.3 U4.4
R5
  Top 0.406: U3.3 49.53,29.21 50.16,28.57 52.7,28.57 53.6,27.68 U4.5
R6
  Top 0.406: U3.2 48.26,28.57 48.9,27.94 52.07,27.94 52.95,27.06 U4.6
R7
  Top 0.406: U4.7 52.3,26.44 51.44,27.3 48.26,27.3 46.99,28.57 U3.1
RESET  (via drill 0.3)
  Top 0.61: C5.1 105.09,27.62 v106.05,28.57 | v107.95,34.29 107.95,42.86 109.28,44.19 U1.1
  Top 0.813: U1.1 109.28,47.47 R5.1 R6.1
  Bottom 0.61: v106.05,28.57 107.95,30.48 v107.95,34.29
RIGHT  (via drill 0.3)
  Top 0.406: RN5.7 52.94,68.34 54.25,67.03 U7.13 54.25,63.23 v55.24,62.23 | v67.31,51.44 67.31,32.07 68.82,30.56 S3.3
  Bottom 0.406: v55.24,62.23 64.77,62.23 67.31,59.69 v67.31,51.44
RXI
  Top 0.61: U1.15 107.28,27.27 104.78,24.77 104.73,6.95 102.55,4.76 J1.TXO
SCK  (via drill 0.3)
  Top 0.406: U5.11 54.37,7.23 52.95,8.64 U4.11 52.95,22.47 53.98,23.5 57.78,23.5 58.42,24.13 58.42,38.1 v57.15,39.37 | v54.61,48.9 54.61,51.44 | 54.61,51.44 56.12,52.95 U6.11 86.11,52.95 v86.43,52.63 | 54.61,51.44 53.66,51.44 53.02,52.07 v53.02,55.24 | 56.19,68.91 v56.19,68.89 55.55,69.52 U7.2 | v101.28,47.63 U1.5
  Bottom 0.406: v86.43,52.63 92.78,52.63 96.52,48.9 100.01,48.9 v101.28,47.63 | v57.15,39.37 54.61,41.91 v54.61,48.9 | v53.02,55.24 53.02,59.37 49.21,63.18 49.21,67.31 50.48,68.58 55.88,68.58 v56.19,68.89
TXO  (via drill 0.3)
  Top 0.61: U1.16 109.28,26.73 107,24.45 107,6.67 v105.73,5.4
  Bottom 0.61: v105.73,5.4 101.6,5.4 100.01,3.81 J1.RXI
UP  (via drill 0.3)
  Top 0.406: RN5.6 52.47,67.55 53.6,66.42 U7.12 53.6,62.6 55.24,60.96 v55.88,60.96 | v66.04,51.44 66.04,21.95 S2.3
  Bottom 0.406: v66.04,51.44 66.04,59.05 64.14,60.96 v55.88,60.96
V_BATT
  Top 0.61: L1.1 85.45,6.71 84.77,6.03 84.77,3.17 85.09,2.86 R1.2
  Top 0.66: U2.6 88.9,7.3
  Top 0.813: 91.76,7.3 88.9,7.3 87,7.3
  Top 1.27: BAT1.PWR@1 97.79,11.11 93.98,7.3 91.76,7.3 | C_IN.1 87,8.2 87,7.3 L1.1

### Text on the board
tPlace: Prototype Batch 2